# EAGLE design Grove - Luminance Sensor v1.0 (EAGLE 6.4)
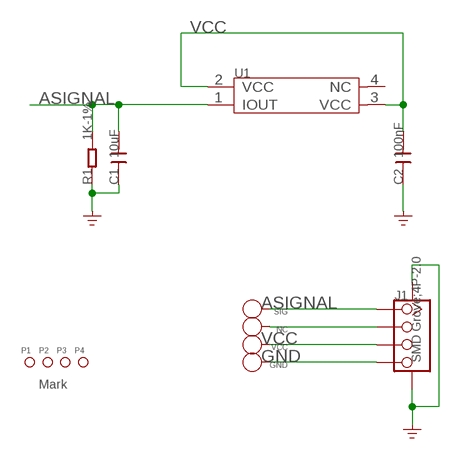
[diagram p0: schematic, sheet 1]

## Parts
C1  10uF  C-0603  [C0603]
C2  100nF  C-0603  [C0603]
GND  PAD-TEST-POINT'4545'  [TP_4545]
J1  SMD Grove;4P-2.0  TWIG-4P-2.0-SMD-FEMALE-REINFORCE'DD'  [4P-SMD-2.0]
NC  PAD-TEST-POINT'4545'  [TP_4545]
P1  PAD-MARK  [ROUND-MARK-1.0]
P2  PAD-MARK  [ROUND-MARK-1.0]
P3  PAD-MARK  [ROUND-MARK-1.0]
P4  PAD-MARK  [ROUND-MARK-1.0]
R1  1K-1%  R-0603  [R0603]
SIG  PAD-TEST-POINT'4545'  [TP_4545]
U1  SENSOR-APDS-9002  [4P-SMD-2X1.25X0.8H]
VCC  PAD-TEST-POINT'4545'  [TP_4545]

## Nets
ASIGNAL: C1.2 J1.1 R1.2 SIG.T U1.1(IOUT)
GND: C1.1 C2.1 GND.T J1.4 J1.SS1 J1.SS2 R1.1
N$1: J1.2 NC.T
VCC: C2.2 J1.3 U1.2(VCC) U1.3(VCC) VCC.T
Unconnected: U1.4(NC)

## Notes on the sheet
- Mark

## Library data of the parts
C1 C2 = Discrete:C*: Ceramic Capacitors
GND NC SIG VCC = Discrete:PAD-TEST-POINT; PARTNO: DNP
J1 = Connector :TWIG-4P-2.0-SMD-FEMALE-REINFORCE
P1-P4 = Discrete:PAD-MARK; PARTNO: DNP
R1 = Discrete:R*
U1 = template:SENSOR-APDS-9002

## Board
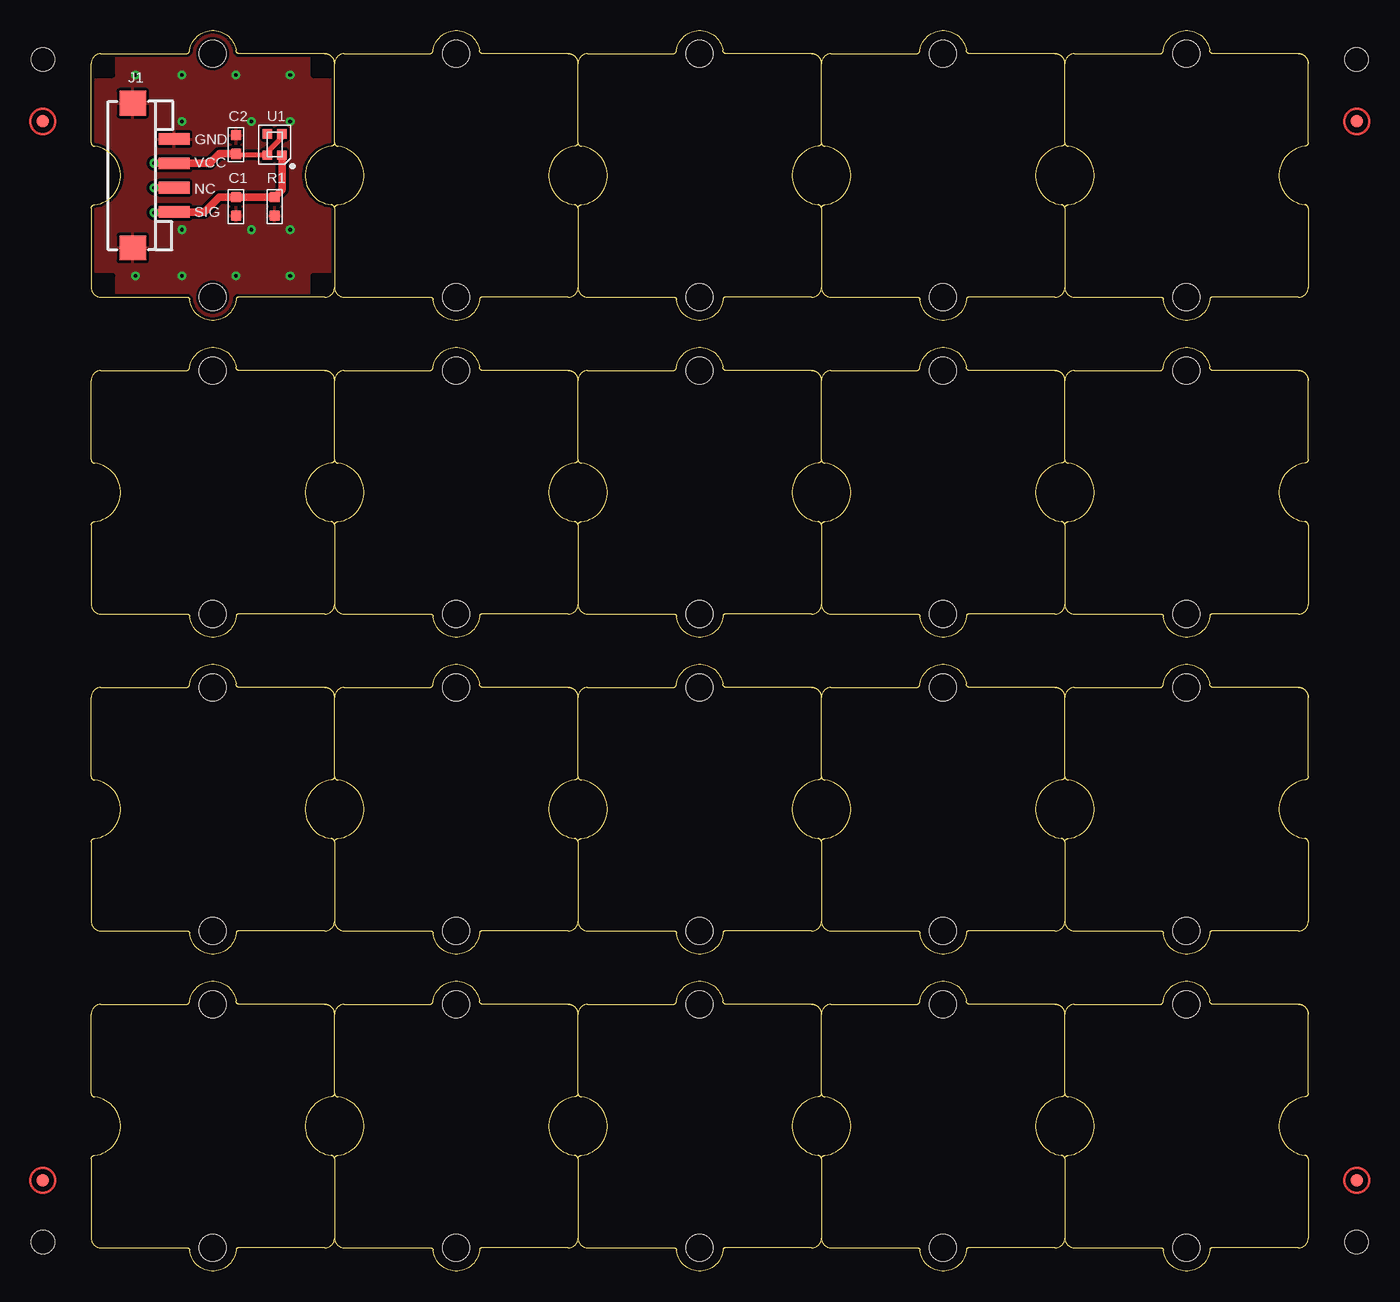
[diagram p1: board, top side]
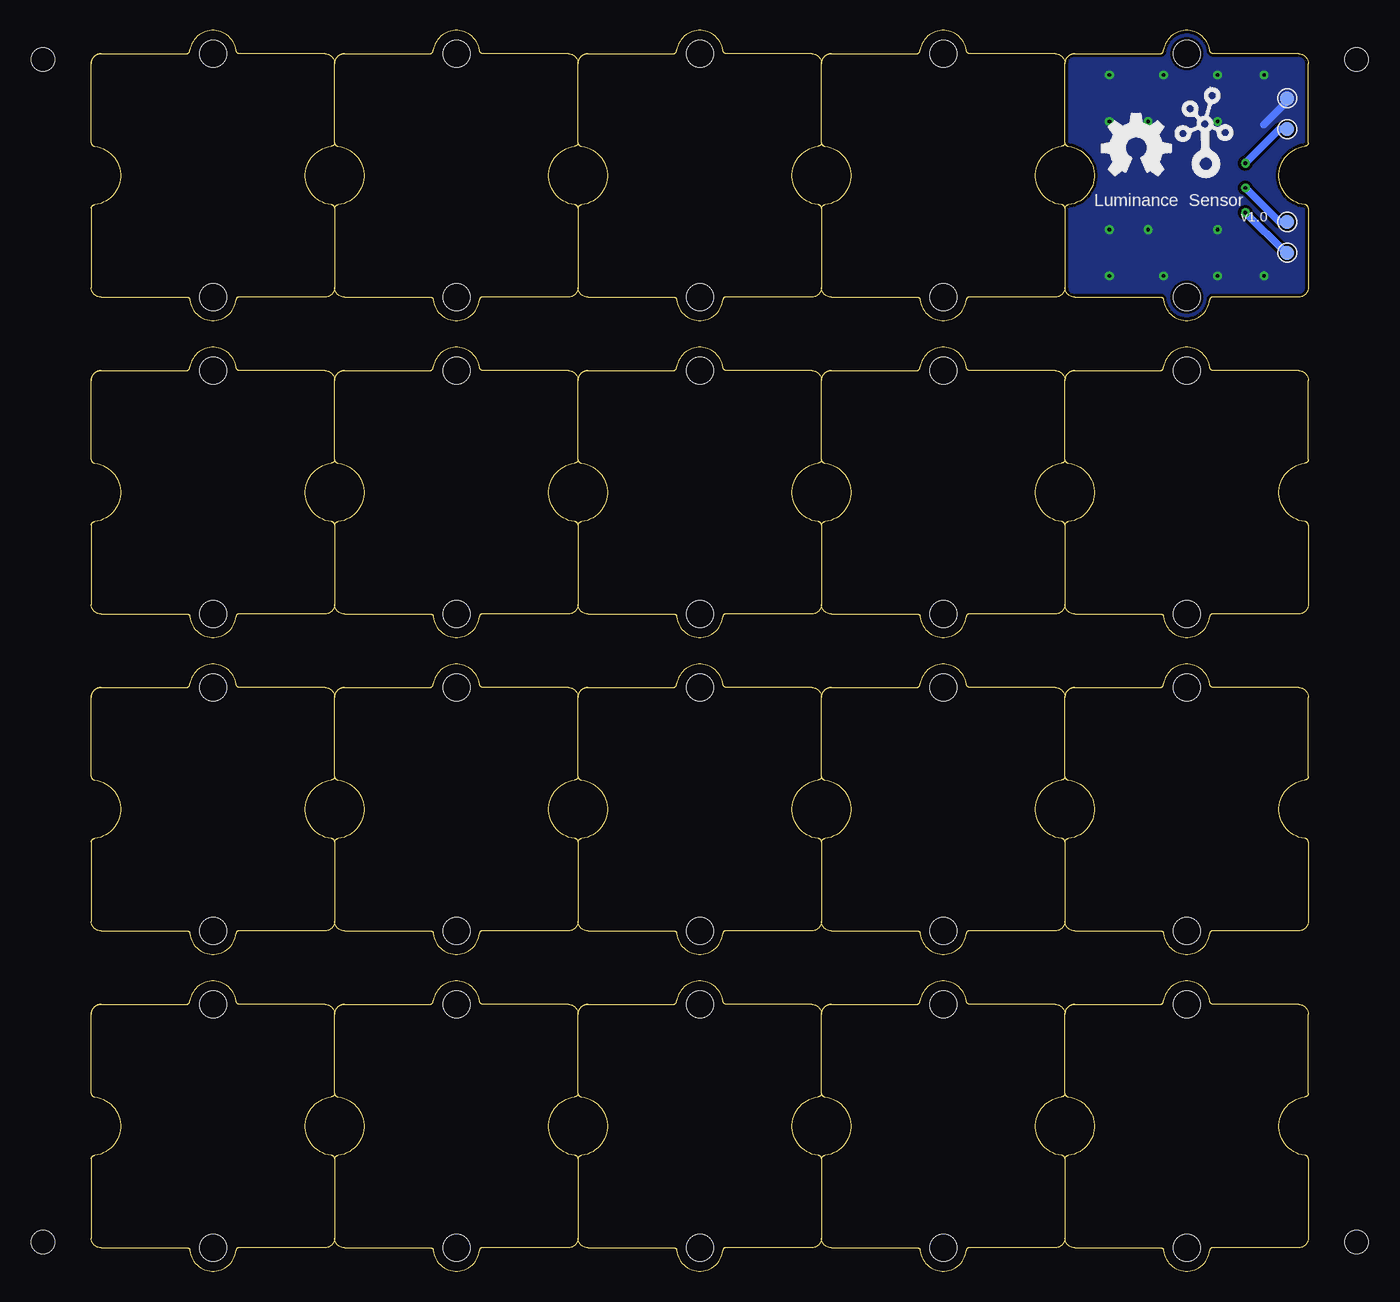
[diagram p2: board, bottom side, seen from below]

Size 100 x 101.93 mm. Coordinates in mm from the lower left corner, seen from the top.
Copper layers (1*16): Top 0.035mm / dielectric 1.5mm / Bottom 0.035mm
Design rules "default *": minimum track width 8mil, minimum drill 12mil, track to track 8mil, track to pad 8mil, pad to pad 8mil, via to via 8mil, smd to smd 0mil, copper to edge 10mil, drill to drill 8mil, minimum pad ring 10mil, minimum via ring 8mil, stop-mask expansion 4mil, vias tented up to drill 25mil, thermal gap 10mil
Holes 1.91 mm at -3.97,2.38 -3.97,99.54 103.98,99.54 103.98,2.38

### Footprints (pad centres in the part's own frame; a part is rotated, then mirrored left to right if it is on the bottom)
C0603 = smd 0.889 x 0.889: 1 -0.762,0; 2 0.762,0
TP_4545 = smd 1.143 x 1.143: T 0,0
4P-SMD-2.0 = smd 0.965 x 2.54: 1 -3,0; 2 -1,0; 3 1,0; 4 3,0 | smd 2.032 x 2.184: SS1 -5.946,3.4; SS2 5.946,3.4
ROUND-MARK-1.0 = smd 1.016 x 1.016: P$1 0,0
R0603 = smd 0.889 x 0.889: 1 -0.762,0; 2 0.762,0
4P-SMD-2X1.25X0.8H = smd 0.75 x 0.75: 1 -0.875,-0.6; 2 -0.875,0.6; 3 0.875,-0.6; 4 0.875,0.6
1U-DIM-W/-DRILL = hole 2.2: 0,-10; 0,10

### Placement (x,y rotation side)
C1  11.9,87.47 90 top
C2  11.9,92.55 270 top
GND  1.74,96.36 180 bottom
J1  6.83,90.01 90 top
NC  1.74,86.2 180 bottom
P1  -3.97,7.46 0 top  (outside the outline)
P2  103.98,7.46 0 top  (outside the outline)
P3  -3.97,94.46 0 top  (outside the outline)
P4  103.98,94.46 0 top  (outside the outline)
R1  15.08,87.47 90 top
SIG  1.74,83.66 180 bottom
U1  15.08,92.55 90 top
U$1  [1U-DIM-W/-DRILL]  10,90.01 0 top
U$4  [OSHW_FILLX200_NOTEXT]  16.98,90.01 0 bottom
U$5  [TWIGLOGO]  8.48,90.78 0 bottom
U$9  [1U-DIM-W/-DRILL]  30,90.01 0 top
U$10  [1U-DIM-W/-DRILL]  50,90.01 0 top
U$11  [1U-DIM-W/-DRILL]  70,90.01 0 top
U$12  [1U-DIM-W/-DRILL]  90,90.01 0 top
U$13  [1U-DIM-W/-DRILL]  30,63.98 0 top
U$14  [1U-DIM-W/-DRILL]  50,63.98 0 top
U$15  [1U-DIM-W/-DRILL]  70,63.98 0 top
U$16  [1U-DIM-W/-DRILL]  90,63.98 0 top
U$17  [1U-DIM-W/-DRILL]  10,63.98 0 top
U$18  [1U-DIM-W/-DRILL]  30,37.94 0 top
U$19  [1U-DIM-W/-DRILL]  50,37.94 0 top
U$20  [1U-DIM-W/-DRILL]  70,37.94 0 top
U$21  [1U-DIM-W/-DRILL]  90,37.94 0 top
U$22  [1U-DIM-W/-DRILL]  10,37.94 0 top
U$23  [1U-DIM-W/-DRILL]  30,11.91 0 top
U$24  [1U-DIM-W/-DRILL]  50,11.91 0 top
U$25  [1U-DIM-W/-DRILL]  70,11.91 0 top
U$26  [1U-DIM-W/-DRILL]  90,11.91 0 top
U$27  [1U-DIM-W/-DRILL]  10,11.91 0 top
VCC  1.74,93.82 180 bottom

### Tracks (layer width: path | path; a pad name or v marks a point on that pad's centre or on a via)
ASIGNAL  (via drill 0.3 pad 0.64)
  Top 0.61: v5.17,86.97 6.78,86.97 J1.1 9.29,87.01 10.51,88.24 C1.2 R1.2 15.68,88.84 U1.1
  Bottom 0.61: SIG.T 1.87,83.66 v5.17,86.97
GND  (via drill 0.3 pad 0.64)
  Bottom 0.61: GND.T 1.74,96.11 3.65,94.2
  other vias: 7.46,94.46 7.46,98.27 3.65,98.27 11.9,98.27 13.18,94.46 16.35,98.27 16.35,94.46 13.18,85.57 16.35,85.57 7.46,85.57 7.46,81.76 11.9,81.76 16.35,81.76 3.65,81.76
  pour Bottom (isolate 0.254): -0.79,102.08 20.8,102.08 20.8,77.95 -0.79,77.95
  pour Top (isolate 0.254): -0.79,102.08 20.8,102.08 20.8,77.95 -0.79,77.95
N$1  (via drill 0.3 pad 0.64)
  Top 0.61: v5.17,89 6.81,89 J1.2
  Bottom 0.61: NC.T 2.38,86.2 v5.17,89
VCC  (via drill 0.3 pad 0.64)
  Top 0.406: U1.3 15.68,93.15 14.57,92.05 14.57,91.77 U1.2 11.89,91.68 11.78,91.79
  Top 0.61: v5.17,91.03 6.81,91.03 J1.3 9.73,91.01 10.51,91.79 11.78,91.79 C2.2
  Bottom 0.61: VCC.T 2.38,93.82 v5.17,91.03

### Text on the board
tPlace: GND | VCC | NC | SIG
bPlace: Luminance Sensor | v1.0